# Altium schematic sheet Core.SchDoc
size A4
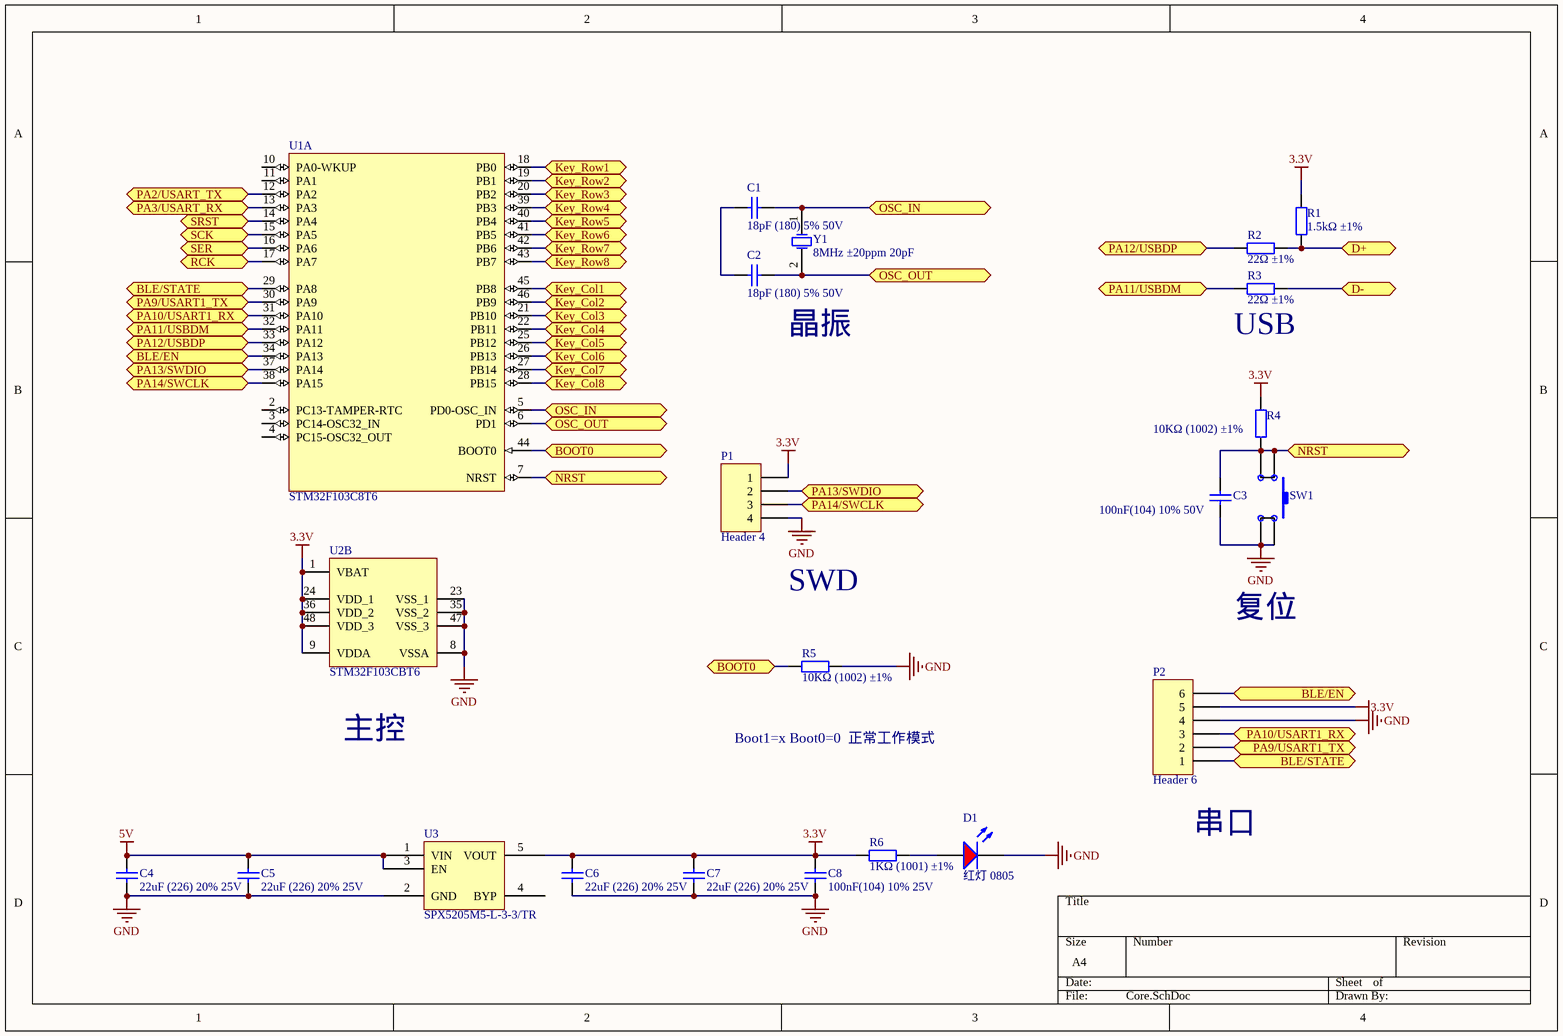
[diagram p0: Core.SchDoc]

## Parts
C1  18pF (180) 5% 50V  [0603_C]
C2  18pF (180) 5% 50V  [0603_C]
C3  100nF(104) 10% 50V  [0603_C]
C4  22uF (226) 20% 25V  [0603_C]
C5  22uF (226) 20% 25V  [0603_C]
C6  22uF (226) 20% 25V  [0603_C]
C7  22uF (226) 20% 25V  [0603_C]
C8  100nF(104) 10% 25V  [0603_C]
D1  红灯 0805  [0603_LED_S1]
P1  Header 4  [HDR1X4]
P2  Header 6  [HDR1X6]
R1  1.5kΩ ±1%  [0603_R]
R2  22Ω ±1%  [0603_R]
R3  22Ω ±1%  [0603_R]
R4  10KΩ (1002) ±1%  [0603_R]
R5  10KΩ (1002) ±1%  [0603_R]
R6  1KΩ (1001) ±1%  [0603_R]
SW1  button  [KEY4]  (value not drawn)
U1  STM32F103C8T6  [LQFP-48_7x7x05P]  (part A of 2)
U2  STM32F103CBT6  [LQFP-48_7x7x05P]  (part B of 2)
U3  SPX5205M5-L-3-3/TR  [SOT-23-5]
Y1  8MHz ±20ppm 20pF  [SMD-5032_2P]

## Ports
BLE/EN, BLE/STATE, BOOT0, D+, D-, Key_Col1, Key_Col2, Key_Col3, Key_Col4, Key_Col5, Key_Col6, Key_Col7, Key_Col8, Key_Row1, Key_Row2, Key_Row3, Key_Row4, Key_Row5, Key_Row6, Key_Row7, Key_Row8, NRST, OSC_IN, OSC_OUT, PA2/USART_TX, PA3/USART_RX, PA9/USART1_TX, PA10/USART1_RX, PA11/USBDM, PA12/USBDP, PA13/SWDIO, PA14/SWCLK, RCK, SCK, SER, SRST

## Nets
3.3V: C6.2 C7.2 C8.2 P1.1 P2.5 R1.1 R4.2 R6.2 U2.1(VBAT) U2.9(VDDA) U2.24(VDD_1) U2.36(VDD_2) U2.48(VDD_3) U3.5(VOUT)
5V: C4.2 C5.2 U3.1(VIN) U3.3(EN)
GND: C3.1 C4.1 C5.1 C6.1 C7.1 C8.1 D1.K P1.4 P2.4 R5.2 SW1.3 SW1.4 U2.8(VSSA) U2.23(VSS_1) U2.35(VSS_2) U2.47(VSS_3) U3.2(GND)
BLE/EN: P2.6 U1.34(PA13) ; port BLE/EN
BLE/STATE: P2.1 U1.29(PA8) ; port BLE/STATE
BOOT0: R5.1 U1.44(BOOT0) ; port BOOT0
D+: R1.2 R2.1 ; port D+
D-: R3.1 ; port D-
Key_Col1: U1.45(PB8) ; port Key_Col1
Key_Col2: U1.46(PB9) ; port Key_Col2
Key_Col3: U1.21(PB10) ; port Key_Col3
Key_Col4: U1.22(PB11) ; port Key_Col4
Key_Col5: U1.25(PB12) ; port Key_Col5
Key_Col6: U1.26(PB13) ; port Key_Col6
Key_Col7: U1.27(PB14) ; port Key_Col7
Key_Col8: U1.28(PB15) ; port Key_Col8
Key_Row1: U1.18(PB0) ; port Key_Row1
Key_Row2: U1.19(PB1) ; port Key_Row2
Key_Row3: U1.20(PB2) ; port Key_Row3
Key_Row4: U1.39(PB3) ; port Key_Row4
Key_Row5: U1.40(PB4) ; port Key_Row5
Key_Row6: U1.41(PB5) ; port Key_Row6
Key_Row7: U1.42(PB6) ; port Key_Row7
Key_Row8: U1.43(PB7) ; port Key_Row8
NRST: C3.2 R4.1 SW1.1 SW1.2 U1.7(NRST) ; port NRST
OSC_IN: C1.1 U1.5(PD0-OSC_IN) Y1.1(OSC1) ; port OSC_IN
OSC_OUT: C2.1 U1.6(PD1) Y1.2(OSC2) ; port OSC_OUT
PA2/USART_TX: U1.12(PA2) ; port PA2/USART_TX
PA3/USART_RX: U1.13(PA3) ; port PA3/USART_RX
PA9/USART1_TX: P2.2 U1.30(PA9) ; port PA9/USART1_TX
PA10/USART1_RX: P2.3 U1.31(PA10) ; port PA10/USART1_RX
PA11/USBDM: R3.2 U1.32(PA11) ; port PA11/USBDM
PA12/USBDP: R2.2 U1.33(PA12) ; port PA12/USBDP
PA13/SWDIO: P1.2 U1.37(PA14) ; port PA13/SWDIO
PA14/SWCLK: P1.3 U1.38(PA15) ; port PA14/SWCLK
RCK: U1.17(PA7) ; port RCK
SCK: U1.15(PA5) ; port SCK
SER: U1.16(PA6) ; port SER
SRST: U1.14(PA4) ; port SRST
NetC1_2: C1.2 C2.2
NetD1_A: D1.A R6.1

Not connected (* = marked no-connect by the designer): U1 2(PC13-TAMPER-RTC) 3(PC14-OSC32_IN) 4(PC15-OSC32_OUT) 10(PA0-WKUP) 11(PA1); U3 4(BYP)

## Notes on the sheet
- 晶振
- (near R3) USB
- SWD
- 复位
- 主控
- Boot1=x Boot0=0  正常工作模式
- (near P2) 串口

## Library data of the parts
C1 C2 = 0603 18pF (180) 5% 50V: 贴片电容; ComponentLink1Description: 供应商链接; ComponentLink1URL: http://www.szlcsc.com/product/details_1999.html; Package: 0603; Supplier: LC; SuppliersPartNumber: C1647
C3 C8 = 0805 100nF(104) 10% 50V: 贴片电容; ComponentLink1Description: 供应商链接; ComponentLink1URL: http://www.szlcsc.com/product/details_50686.html; Package: 0805; Supplier: LC; SuppliersPartNumber: C49678
C4-C7 = 0805 22uF (226) 20% 25V: 贴片电容; ComponentLink1Description: 供应商链接; ComponentLink1URL: http://www.szlcsc.com/product/details_46786.html; Package: 0805; Supplier: LC; SuppliersPartNumber: C45783
D1 = 0805 红灯: 发光二极管; ComponentLink1Description: 供应商链接; ComponentLink1URL: http://www.szlcsc.com/product/details_2668.html; Package: 0805; Supplier: LC; SuppliersPartNumber: C2295
P1 = Header 4: Header, 4-Pin; LatestRevisionDate: 17-Jul-2002; LatestRevisionNote: Re-released for DXP Platform.; Publisher: Altium Limited
P2 = Header 6: Header, 6-Pin; LatestRevisionDate: 17-Jul-2002; LatestRevisionNote: Re-released for DXP Platform.; Publisher: Altium Limited
R1-R5 = 0805 10KΩ (1002) 1%: 贴片电阻; ComponentLink1Description: 供应商链接; ComponentLink1URL: http://www.szlcsc.com/product/details_18102.html; Package: 0805; Supplier: LC; SuppliersPartNumber: C17414
R6 = 0805 1KΩ (1001) 1%: 贴片电阻; ComponentLink1Description: 供应商链接; ComponentLink1URL: http://www.szlcsc.com/product/details_18201.html; Package: 0805; Supplier: LC; SuppliersPartNumber: C17513
U1 = STM32F103C8T6: ARM; ComponentLink1Description: 供应商链接; ComponentLink1URL: http://www.szlcsc.com/product/details_9243.html; Package: LQFP-48_7x7x05P; Supplier: LC; SuppliersPartNumber: C8734
U2 = STM32F103CBT6: ARM; ComponentLink1Description: 供应商链接; ComponentLink1URL: http://www.szlcsc.com/product/details_8796.html; Package: LQFP-48_7x7x05P; Supplier: LC; SuppliersPartNumber: C8304
Y1 = SMD-5032_2P 8MHz 20ppm 20pF: 贴片晶振; ComponentLink1Description: 供应商链接; ComponentLink1URL: http://www.szlcsc.com/product/details_117214.html; Package: SMD-5032_2P; Supplier: LC; SuppliersPartNumber: C115962